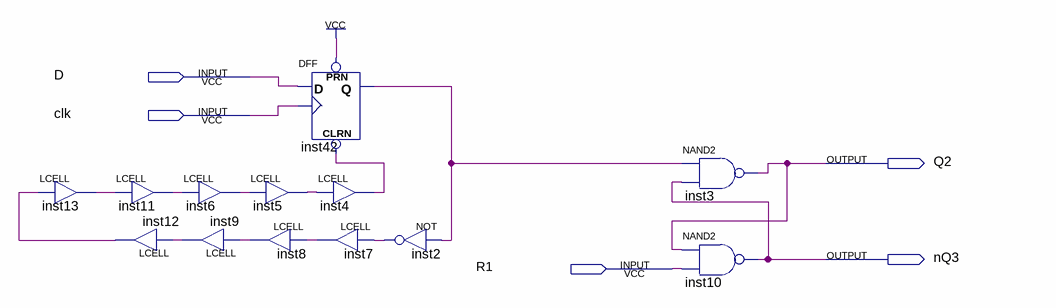
[diagram p0: schematic sheet]
// Quartus schematic t6.bdf as structural Verilog: 13 symbols, 5 pins
module t6 (
  input  D,
  input  clk,
  input  R1,
  output Q2,
  output nQ3
);

  wire inst2_out, inst4_out, inst5_out, inst6_out, inst7_out, inst8_out, inst9_out, inst11_out, inst12_out,
       inst13_out, inst42_q;

  LCELL inst13 (.IN(inst12_out), .OUT(inst13_out));
  LCELL inst11 (.IN(inst13_out), .OUT(inst11_out));
  LCELL inst12 (.IN(inst9_out), .OUT(inst12_out));
  LCELL inst6 (.IN(inst11_out), .OUT(inst6_out));
  LCELL inst9 (.IN(inst8_out), .OUT(inst9_out));
  LCELL inst5 (.IN(inst6_out), .OUT(inst5_out));
  LCELL inst8 (.IN(inst7_out), .OUT(inst8_out));
  DFF inst42 (.CLRN(inst4_out), .CLK(clk), .D(D), .PRN(1'b1), .Q(inst42_q));
  LCELL inst4 (.IN(inst5_out), .OUT(inst4_out));
  LCELL inst7 (.IN(inst2_out), .OUT(inst7_out));
  not inst2 (inst2_out, inst42_q);
  nand inst3 (Q2, inst42_q, nQ3);
  nand inst10 (nQ3, Q2, R1);
endmodule
